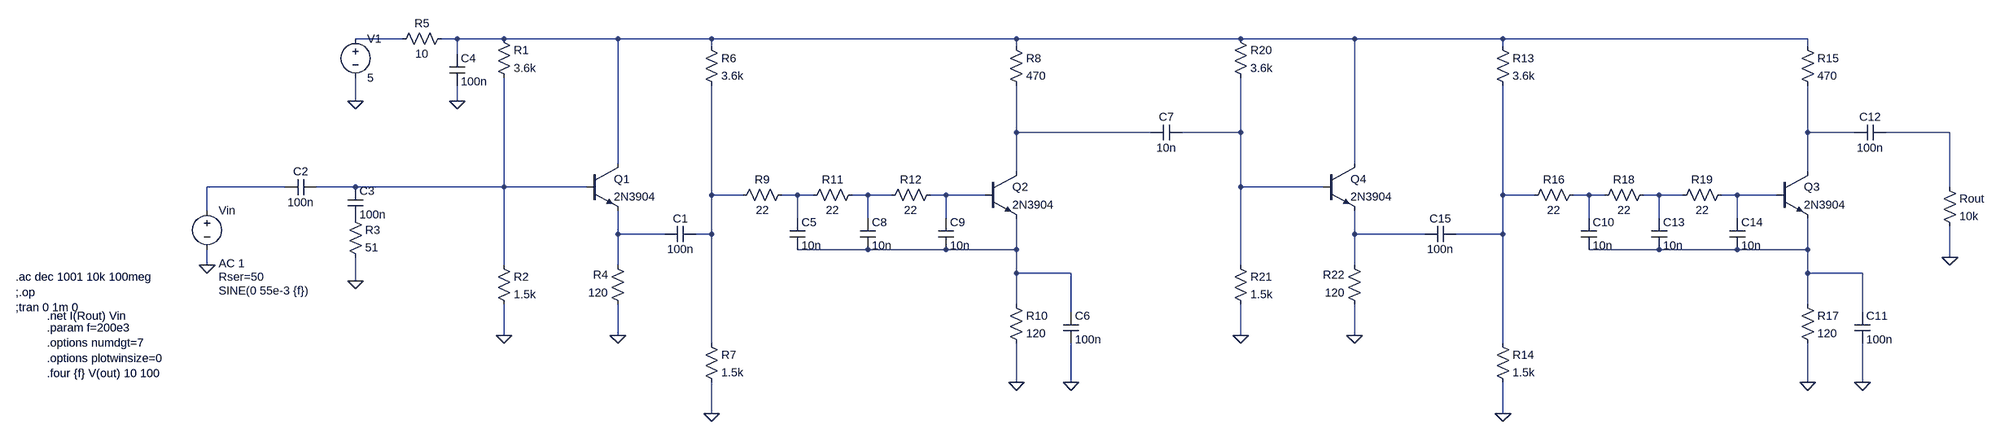
[diagram p0: schematic complicated_IF_amp_cascade.asc]
complicated_IF_amp_cascade.asc, the LTspice schematic file:
Version 4
SHEET 1 4096 680
WIRE 256 -176 160 -176
WIRE 368 -176 336 -176
WIRE 464 -176 368 -176
WIRE 752 -176 464 -176
WIRE 944 -176 752 -176
WIRE 1568 -176 944 -176
WIRE 2464 -176 1568 -176
WIRE 2752 -176 2464 -176
WIRE 3056 -176 2752 -176
WIRE 3680 -176 3056 -176
WIRE 944 -160 944 -176
WIRE 1568 -160 1568 -176
WIRE 3056 -160 3056 -176
WIRE 3680 -160 3680 -176
WIRE 368 -144 368 -176
WIRE 160 -48 160 -96
WIRE 368 -48 368 -80
WIRE 1568 16 1568 -80
WIRE 2240 16 1568 16
WIRE 2464 16 2464 -96
WIRE 2464 16 2304 16
WIRE 3680 16 3680 -80
WIRE 3776 16 3680 16
WIRE 4016 16 3840 16
WIRE 752 80 752 -176
WIRE 2752 80 2752 -176
WIRE 1568 96 1568 16
WIRE 3680 96 3680 16
WIRE 16 128 -144 128
WIRE 160 128 80 128
WIRE 464 128 464 -96
WIRE 464 128 160 128
WIRE 688 128 464 128
WIRE 2464 128 2464 16
WIRE 2688 128 2464 128
WIRE 4016 128 4016 16
WIRE 944 144 944 -80
WIRE 1008 144 944 144
WIRE 1120 144 1088 144
WIRE 1152 144 1120 144
WIRE 1264 144 1232 144
WIRE 1312 144 1264 144
WIRE 1424 144 1392 144
WIRE 1504 144 1424 144
WIRE 3056 144 3056 -80
WIRE 3120 144 3056 144
WIRE 3232 144 3200 144
WIRE 3264 144 3232 144
WIRE 3376 144 3344 144
WIRE 3424 144 3376 144
WIRE 3536 144 3504 144
WIRE 3616 144 3536 144
WIRE -144 176 -144 128
WIRE 1120 192 1120 144
WIRE 1264 192 1264 144
WIRE 1424 192 1424 144
WIRE 3232 192 3232 144
WIRE 3376 192 3376 144
WIRE 3536 192 3536 144
WIRE 752 224 752 176
WIRE 848 224 752 224
WIRE 944 224 944 144
WIRE 944 224 912 224
WIRE 2752 224 2752 176
WIRE 2896 224 2752 224
WIRE 3056 224 3056 144
WIRE 3056 224 2960 224
WIRE 1264 256 1120 256
WIRE 1424 256 1264 256
WIRE 1568 256 1568 192
WIRE 1568 256 1424 256
WIRE 3376 256 3232 256
WIRE 3536 256 3376 256
WIRE 3680 256 3680 192
WIRE 3680 256 3536 256
WIRE 4016 272 4016 208
WIRE -144 288 -144 256
WIRE 464 288 464 128
WIRE 752 288 752 224
WIRE 2464 288 2464 128
WIRE 2752 288 2752 224
WIRE 1568 304 1568 256
WIRE 1680 304 1568 304
WIRE 3680 304 3680 256
WIRE 3792 304 3680 304
WIRE 160 320 160 272
WIRE 1568 368 1568 304
WIRE 3680 368 3680 304
WIRE 1680 384 1680 304
WIRE 3792 384 3792 304
WIRE 464 432 464 368
WIRE 752 432 752 368
WIRE 2464 432 2464 368
WIRE 2752 432 2752 368
WIRE 944 448 944 224
WIRE 3056 448 3056 224
WIRE 1568 528 1568 448
WIRE 1680 528 1680 448
WIRE 3680 528 3680 448
WIRE 3792 528 3792 448
WIRE 944 592 944 528
WIRE 3056 592 3056 528
FLAG 464 432 0
FLAG 752 432 0
FLAG 160 -48 0
FLAG -144 288 0
FLAG 368 -48 0
FLAG 160 320 0
FLAG 944 592 0
FLAG 1568 528 0
FLAG 1680 528 0
FLAG 3056 592 0
FLAG 3680 528 0
FLAG 3792 528 0
FLAG 4016 272 0
FLAG 2464 432 0
FLAG 2752 432 0
SYMBOL npn 688 80 R0
SYMATTR InstName Q1
SYMATTR Value 2N3904
SYMBOL res 448 -192 R0
SYMATTR InstName R1
SYMATTR Value 3.6k
SYMBOL res 448 272 R0
SYMATTR InstName R2
SYMATTR Value 1.5k
SYMBOL res 768 384 R180
WINDOW 0 36 76 Left 2
WINDOW 3 36 40 Left 2
SYMATTR InstName R4
SYMATTR Value 120
SYMBOL cap 16 144 R270
WINDOW 0 32 32 VTop 2
WINDOW 3 0 32 VBottom 2
SYMATTR InstName C2
SYMATTR Value 100n
SYMBOL voltage 160 -192 R0
WINDOW 123 0 0 Left 0
WINDOW 39 0 0 Left 0
SYMATTR InstName V1
SYMATTR Value 5
SYMBOL voltage -144 160 R0
WINDOW 3 24 180 Left 2
WINDOW 123 24 124 Left 2
WINDOW 39 24 152 Left 2
SYMATTR Value SINE(0 55e-3 {f})
SYMATTR Value2 AC 1
SYMATTR SpiceLine Rser=50
SYMATTR InstName Vin
SYMBOL res 352 -192 R90
WINDOW 0 0 56 VBottom 2
WINDOW 3 32 56 VTop 2
SYMATTR InstName R5
SYMATTR Value 10
SYMBOL cap 352 -144 R0
SYMATTR InstName C4
SYMATTR Value 100n
SYMBOL cap 848 240 R270
WINDOW 0 32 32 VTop 2
WINDOW 3 0 32 VBottom 2
SYMATTR InstName C1
SYMATTR Value 100n
SYMBOL cap 144 128 R0
SYMATTR InstName C3
SYMATTR Value 100n
SYMBOL res 144 176 R0
SYMATTR InstName R3
SYMATTR Value 51
SYMBOL npn 1504 96 R0
SYMATTR InstName Q2
SYMATTR Value 2N3904
SYMBOL res 928 -176 R0
SYMATTR InstName R6
SYMATTR Value 3.6k
SYMBOL res 928 432 R0
SYMATTR InstName R7
SYMATTR Value 1.5k
SYMBOL res 1552 -176 R0
SYMATTR InstName R8
SYMATTR Value 470
SYMBOL res 1104 128 R90
WINDOW 0 0 56 VBottom 2
WINDOW 3 32 56 VTop 2
SYMATTR InstName R9
SYMATTR Value 22
SYMBOL cap 1104 192 R0
SYMATTR InstName C5
SYMATTR Value 10n
SYMBOL res 1552 352 R0
SYMATTR InstName R10
SYMATTR Value 120
SYMBOL cap 1664 384 R0
SYMATTR InstName C6
SYMATTR Value 100n
SYMBOL cap 2304 0 R90
WINDOW 0 0 32 VBottom 2
WINDOW 3 32 32 VTop 2
SYMATTR InstName C7
SYMATTR Value 10n
SYMBOL res 1248 128 R90
WINDOW 0 0 56 VBottom 2
WINDOW 3 32 56 VTop 2
SYMATTR InstName R11
SYMATTR Value 22
SYMBOL cap 1248 192 R0
SYMATTR InstName C8
SYMATTR Value 10n
SYMBOL res 1408 128 R90
WINDOW 0 0 56 VBottom 2
WINDOW 3 32 56 VTop 2
SYMATTR InstName R12
SYMATTR Value 22
SYMBOL cap 1408 192 R0
SYMATTR InstName C9
SYMATTR Value 10n
SYMBOL npn 3616 96 R0
SYMATTR InstName Q3
SYMATTR Value 2N3904
SYMBOL res 3040 -176 R0
SYMATTR InstName R13
SYMATTR Value 3.6k
SYMBOL res 3040 432 R0
SYMATTR InstName R14
SYMATTR Value 1.5k
SYMBOL res 3664 -176 R0
SYMATTR InstName R15
SYMATTR Value 470
SYMBOL res 3216 128 R90
WINDOW 0 0 56 VBottom 2
WINDOW 3 32 56 VTop 2
SYMATTR InstName R16
SYMATTR Value 22
SYMBOL cap 3216 192 R0
SYMATTR InstName C10
SYMATTR Value 10n
SYMBOL res 3664 352 R0
SYMATTR InstName R17
SYMATTR Value 120
SYMBOL cap 3776 384 R0
SYMATTR InstName C11
SYMATTR Value 100n
SYMBOL cap 3840 0 R90
WINDOW 0 0 32 VBottom 2
WINDOW 3 32 32 VTop 2
SYMATTR InstName C12
SYMATTR Value 100n
SYMBOL res 4000 112 R0
SYMATTR InstName Rout
SYMATTR Value 10k
SYMBOL res 3360 128 R90
WINDOW 0 0 56 VBottom 2
WINDOW 3 32 56 VTop 2
SYMATTR InstName R18
SYMATTR Value 22
SYMBOL cap 3360 192 R0
SYMATTR InstName C13
SYMATTR Value 10n
SYMBOL res 3520 128 R90
WINDOW 0 0 56 VBottom 2
WINDOW 3 32 56 VTop 2
SYMATTR InstName R19
SYMATTR Value 22
SYMBOL cap 3520 192 R0
SYMATTR InstName C14
SYMATTR Value 10n
SYMBOL npn 2688 80 R0
SYMATTR InstName Q4
SYMATTR Value 2N3904
SYMBOL res 2448 -192 R0
SYMATTR InstName R20
SYMATTR Value 3.6k
SYMBOL res 2448 272 R0
SYMATTR InstName R21
SYMATTR Value 1.5k
SYMBOL res 2768 384 R180
WINDOW 0 36 76 Left 2
WINDOW 3 36 40 Left 2
SYMATTR InstName R22
SYMATTR Value 120
SYMBOL cap 2960 208 R90
WINDOW 0 0 32 VBottom 2
WINDOW 3 32 32 VTop 2
SYMATTR InstName C15
SYMATTR Value 100n
TEXT -472 392 Left 2 !.net I(Rout) Vin
TEXT -536 312 Left 2 !.ac dec 1001 10k 100meg\n;.op\n;tran 0 1m 0
TEXT -472 416 Left 2 !.param f=200e3\n.options numdgt=7\n.options plotwinsize=0\n.four {f} V(out) 10 100

The netlist it stands for:
* complicated_IF_amp_cascade.asc
Q1 N002 N008 N017 0 2N3904
R1 N002 N008 3.6k
R2 N008 0 1.5k
R4 0 N017 120
C2 N007 N008 100n
V1 N001 0 5
Vin N007 0 SINE(0 55e-3 {f}) AC 1 Rser=50
R5 N002 N001 10
C4 N002 0 100n
C1 N017 N009 100n
C3 N008 P001 100n
R3 P001 0 51
Q2 N003 N012 N019 0 2N3904
R6 N002 N009 3.6k
R7 N009 0 1.5k
R8 N002 N003 470
R9 N010 N009 22
C5 N010 N019 10n
R10 N019 0 120
C6 N019 0 100n
C7 N004 N003 10n
R11 N011 N010 22
C8 N011 N019 10n
R12 N012 N011 22
C9 N012 N019 10n
Q3 N005 N016 N020 0 2N3904
R13 N002 N013 3.6k
R14 N013 0 1.5k
R15 N002 N005 470
R16 N014 N013 22
C10 N014 N020 10n
R17 N020 0 120
C11 N020 0 100n
C12 N006 N005 100n
Rout N006 0 10k
R18 N015 N014 22
C13 N015 N020 10n
R19 N016 N015 22
C14 N016 N020 10n
Q4 N002 N004 N018 0 2N3904
R20 N002 N004 3.6k
R21 N004 0 1.5k
R22 0 N018 120
C15 N013 N018 100n
.model NPN NPN
.model PNP PNP
.lib standard.bjt
.net I(Rout) Vin
.ac dec 1001 10k 100meg
;.op
;tran 0 1m 0
.param f=200e3
.options numdgt=7
.options plotwinsize=0
.four {f} V(out) 10 100
.backanno
.end